# Altium schematic sheet stepper_driver.SchDoc
size A4
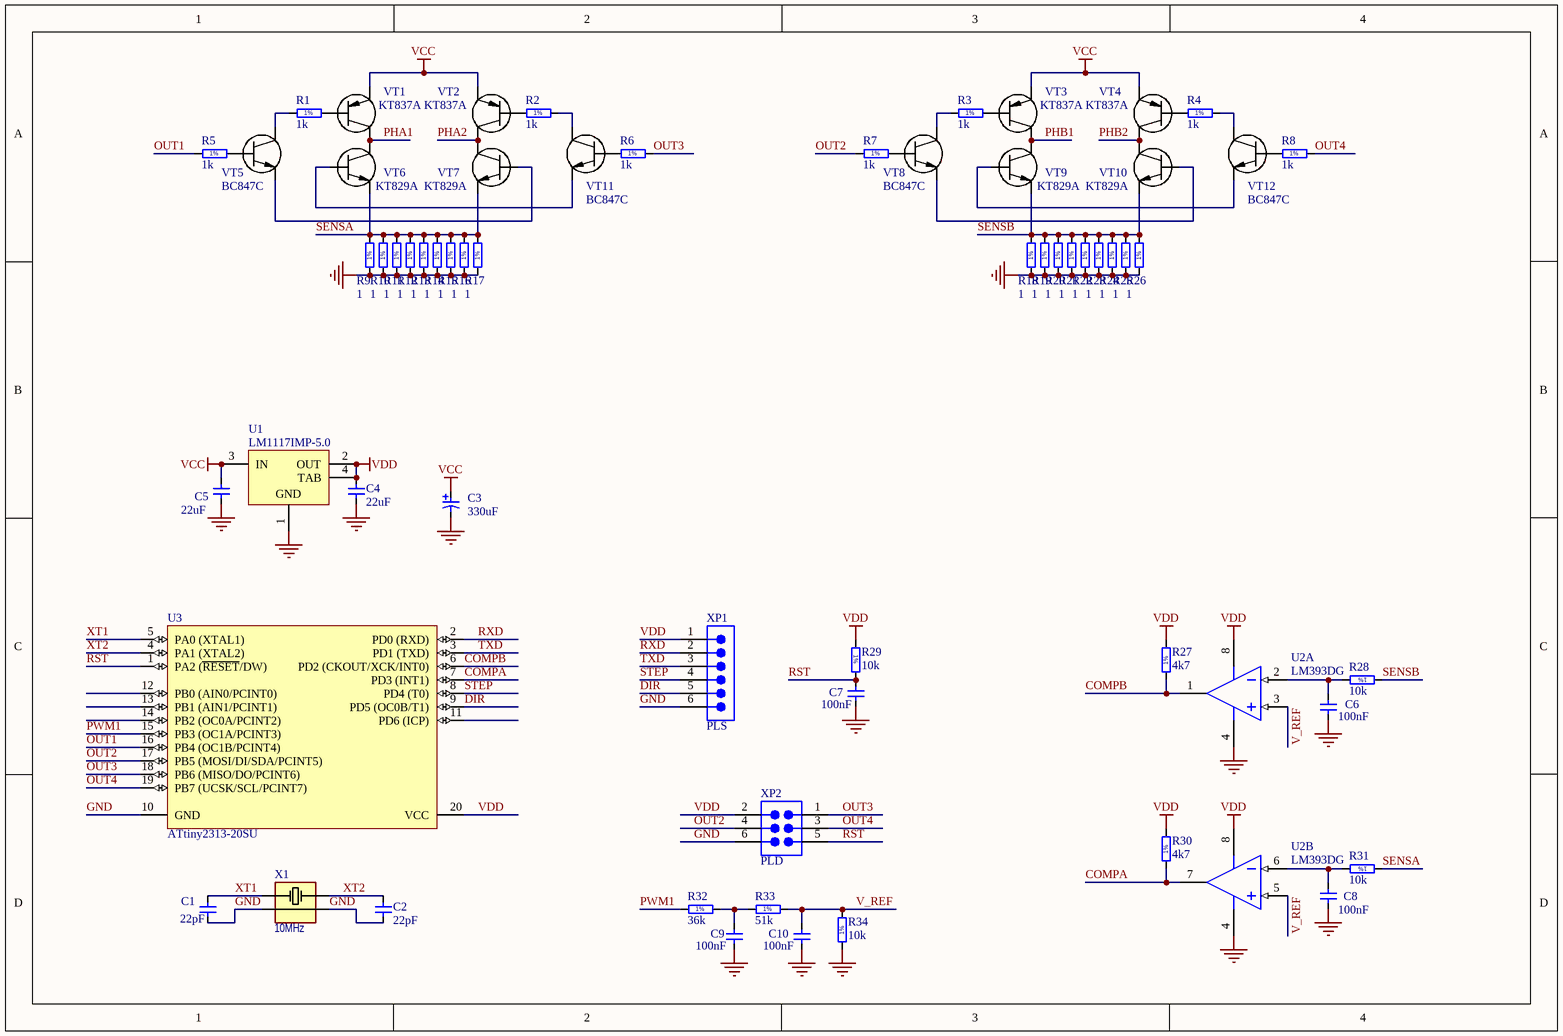
[diagram p0: stepper_driver.SchDoc]

## Parts
C1  22pF  [CAP0805R]
C2  22pF  [CAP0805R]
C3  330uF  [TAN_D]
C4  22uF  [CAP0805R]
C5  22uF  [CAP0805R]
C6  100nF  [CAP0805R]
C7  100nF  [CAP0805R]
C8  100nF  [CAP0805R]
C9  100nF  [CAP0805R]
C10  100nF  [CAP0805R]
R1  1k  [RES0805R]
R2  1k  [RES0805R]
R3  1k  [RES0805R]
R4  1k  [RES0805R]
R5  1k  [RES0805R]
R6  1k  [RES0805R]
R7  1k  [RES0805R]
R8  1k  [RES0805R]
R9  1  [RES1206R]
R10  1  [RES1206R]
R11  1  [RES1206R]
R12  1  [RES1206R]
R13  1  [RES1206R]
R14  1  [RES1206R]
R15  1  [RES1206R]
R16  1  [RES1206R]
R17  1  [RES1206R]
R18  1  [RES1206R]
R19  1  [RES1206R]
R20  1  [RES1206R]
R21  1  [RES1206R]
R22  1  [RES1206R]
R23  1  [RES1206R]
R24  1  [RES1206R]
R25  1  [RES1206R]
R26  1  [RES1206R]
R27  4k7  [RES0805R]
R28  10k  [RES0805R]
R29  10k  [RES0805R]
R30  4k7  [RES0805R]
R31  10k  [RES0805R]
R32  36k  [RES0805R]
R33  51k  [RES0805R]
R34  10k  [RES0805R]
U1  LM1117IMP-5.0  [MP04A_N]
U2  LM393DG  [ONSC-SOIC-8-751-07_V]  (parts A,B of 2)
U3  ATtiny2313-20SU  [20S_L]
VT1  KT837A  [D2PAK]
VT2  KT837A  [D2PAK]
VT3  KT837A  [D2PAK]
VT4  KT837A  [D2PAK]
VT5  BC847C  [SOT23]
VT6  KT829A  [D2PAK]
VT7  KT829A  [D2PAK]
VT8  BC847C  [SOT23]
VT9  KT829A  [D2PAK]
VT10  KT829A  [D2PAK]
VT11  BC847C  [SOT23]
VT12  BC847C  [SOT23]
X1  10MHz  [5032]
XP1  PLS  [PLS-06]
XP2  PLD  [PLD-06]

## Nets
GND: C1.1 C2.1 C3.2 C4.1 C5.1 C6.1 C7.1 C8.1 C9.1 C10.1 R9.1 R10.1 R11.1 R12.1 R13.1 R14.1 R15.1 R16.1 R17.1 R18.1 R19.1 R20.1 R21.1 R22.1 R23.1 R24.1 R25.1 R26.1 R34.1 U1.1(GND) U2.4(GND) U3.10(GND) X1.2 X1.4 XP1.6 XP2.6
VCC: C3.1 C5.2 U1.3(IN) VT1.1(E) VT2.1(E) VT3.1(E) VT4.1(E)
VDD: C4.2 R27.2 R29.1 R30.2 U1.2(OUT) U1.4(TAB) U2.8(VCC) U3.20(VCC) XP1.1 XP2.2
COMPA: R30.1 U2.7(OUTB) U3.7(PD3_(INT1))
COMPB: R27.1 U2.1(OUTA) U3.6(PD2_(CKOUT/XCK/INT0))
DIR: U3.9(PD5_(OC0B/T1)) XP1.5
OUT1: R5.1 U3.16(PB4_(OC1B/PCINT4))
OUT2: R7.1 U3.17(PB5_(MOSI/DI/SDA/PCINT5)) XP2.4
OUT3: R6.2 U3.18(PB6_(MISO/DO/PCINT6)) XP2.1
OUT4: R8.2 U3.19(PB7_(UCSK/SCL/PCINT7)) XP2.3
PHA1: VT1.3(C) VT6.3(C)
PHA2: VT2.3(C) VT7.3(C)
PHB1: VT3.3(C) VT9.3(C)
PHB2: VT4.3(C) VT10.3(C)
PWM1: R32.1 U3.15(PB3_(OC1A/PCINT3))
RST: C7.2 R29.2 U3.1(PA2_(~{RESET}/DW)) XP2.5
RXD: U3.2(PD0_(RXD)) XP1.2
SENSA: R9.2 R10.2 R11.2 R12.2 R13.2 R14.2 R15.2 R16.2 R17.2 R31.1 VT6.2(E) VT7.2(E)
SENSB: R18.2 R19.2 R20.2 R21.2 R22.2 R23.2 R24.2 R25.2 R26.2 R28.1 VT9.2(E) VT10.2(E)
STEP: U3.8(PD4_(T0)) XP1.4
TXD: U3.3(PD1_(TXD)) XP1.3
V_REF: C10.2 R33.2 R34.2 U2.3(INA+) U2.5(INB+)
XT1: C1.2 U3.5(PA0_(XTAL1)) X1.1
XT2: C2.2 U3.4(PA1_(XTAL2)) X1.3
NetC6_2: C6.2 R28.2 U2.2(INA-)
NetC8_2: C8.2 R31.2 U2.6(INB-)
NetC9_2: C9.2 R32.2 R33.1
NetR1_1: R1.1 VT5.3(C)
NetR1_2: R1.2 VT1.2(B)
NetR2_1: R2.1 VT2.2(B)
NetR2_2: R2.2 VT11.3(C)
NetR3_1: R3.1 VT8.3(C)
NetR3_2: R3.2 VT3.2(B)
NetR4_1: R4.1 VT4.2(B)
NetR4_2: R4.2 VT12.3(C)
NetR5_2: R5.2 VT5.1(B)
NetR6_1: R6.1 VT11.1(B)
NetR7_2: R7.2 VT8.1(B)
NetR8_1: R8.1 VT12.1(B)
NetVT5_2: VT5.2(E) VT7.1(B)
NetVT6_1: VT6.1(B) VT11.2(E)
NetVT8_2: VT8.2(E) VT10.1(B)
NetVT9_1: VT9.1(B) VT12.2(E)

Not connected (* = marked no-connect by the designer): U3 11(PD6_(ICP)) 12(PB0_(AIN0/PCINT0)) 13(PB1_(AIN1/PCINT1)) 14(PB2_(OC0A/PCINT2))

## Notes on the sheet
- (in symbol R0805_1K_1%_0.125W_100PPM) 1%
- (in symbol R0805_4K7_1%_0.125W_100PPM) 1%
- (in symbol R0805_10K_1%_0.125W_100PPM) 1%
- (in symbol R0805_36K_1%_0.125W_100PPM) 1%
- (in symbol R0805_51K_1%_0.125W_100PPM) 1%
- (in symbol R1206_1R_1%_0.25W_200PPM) 1%

## Library data of the parts
C1 C2 = CC0805_22PF_50V_5%_NP0: SMD 0805 Capacitor; Part Description: SMD Multilayer Chip Ceramic Capacitor; Manufacturer: GENERIC; Manufacturer1 Part Number: 223886115229; Voltage: 50V; TC: NP0; Tolerance: ±5%; Table: Capacitors SMD; Part Number: CC0805_22PF_50V_5%_NP0; Component Kind: Standard; Component Type: Standard; Pin Count: 2; Value: 22pF; Status: Preferred; Manufacturer Part Number: CC0805_22PF_50V_5%_NP0; Case: 0805; Mounted: Yes; Socket: No; SMD: Yes; Manufacturer1 Example: PHYCOMP; Manufacturer1 ComponentHeight: 1.35mm; HelpURL: \\cern.ch\dfs\Applications\Altium\Datasheets\CC0805_NP0_PHYCOMP.pdf; Author: I. Kuznetsov; CreateDate: 03.12.2007; LatestRevisionDate: 03.12.2007; Manufacturer Part Number 2: CC0805JPNPO9BN220
C3 = T495D337M010AHE100: Voltage: 10V; Table: Tantalum; Part Number: T495D337M010AHE100; Value: 330uF
C4 C5 = CC0805_22UF_16V_10%_X5R: SMD 0805 Capacitor; Part Description: SMD Multilayer Chip Ceramic Capacitor; Manufacturer: GENERIC; Manufacturer1 Part Number: C2012X5R1C226KT; Voltage: 16V; TC: X5R; Tolerance: ±10%; Table: Capacitors SMD; Part Number: CC0805_22UF_16V_10%_X5R; Component Kind: Standard; Component Type: Standard; Pin Count: 2; Value: 22uF; Status: Preferred; Manufacturer Part Number: CC0805_22UF_16V_10%_X5R; Case: 0805; Mounted: Yes; Socket: No; SMD: Yes; Manufacturer1 Example: TDK; Manufacturer1 ComponentHeight: 1.35mm; HelpURL: \\cern.ch\dfs\Applications\Altium\Datasheets\CC0805_X5R_TDK_C.pdf; Author: I. Kuznetsov; CreateDate: 25.10.2012; LatestRevisionDate: 25.10.2012
C6-C10 = CC0805_100NF_50V_10%_X7R: SMD 0805 Capacitor; Part Description: SMD Multilayer Chip Ceramic Capacitor; Manufacturer: GENERIC; Manufacturer1 Part Number: B37941K5104K62; Voltage: 50V; TC: X7R; Tolerance: ±10%; Table: Capacitors SMD; Part Number: CC0805_100NF_50V_10%_X7R; Component Kind: Standard; Component Type: Standard; Pin Count: 2; Value: 100nF; Status: Preferred; Manufacturer Part Number: CC0805_100NF_50V_10%_X7R; Case: 0805; Mounted: Yes; Socket: No; SMD: Yes; Manufacturer1 Example: EPCOS; Manufacturer1 ComponentHeight: 1.35mm; HelpURL: \\cern.ch\dfs\Applications\Altium\Datasheets\CC0805_X7R_EPCOS.pdf; Author: I. Kuznetsov; CreateDate: 03.12.2007; LatestRevisionDate: 03.12.2007
R1-R8 = R0805_1K_1%_0.125W_100PPM: Part Description: General Purpose Thick Film Chip Resistor; Manufacturer: GENERIC; Manufacturer1 Part Number: NRC10F1001TRF; Power: 0.125W; TC: ±100ppm/°C; Tolerance: ±1%; Table: Resistors SMD; Part Number: R0805_1K_1%_0.125W_100PPM; Component Kind: Standard; Component Type: Standard; Footprint: RESC2012X60N; Pin Count: 2; Value: 1k; Status: Preferred; Manufacturer Part Number: R0805_1K_1%_0.125W_100PPM; Case: 0805; Mounted: Yes; Socket: No; SMD: Yes; Manufacturer1 Example: NIC COMPONENT; Manufacturer1 ComponentHeight: 0.6mm; HelpURL: \\cern.ch\dfs\Applications\Altium\Datasheets\R0805_NIC_NRC.pdf; Author: CERN DEM JLC; CreateDate: 03.12.2007; LatestRevisionDate: 13.03.2008
R9-R26 = R1206_1R_1%_0.25W_200PPM: Part Description: General Purpose Thick Film Chip Resistor; Manufacturer: GENERIC; Manufacturer1 Part Number: 232272461008L or RC1206FR-071RL; Power: 0.25W; TC: ±200ppm/°C; Tolerance: ±1%; Table: Resistors SMD; Part Number: R1206_1R_1%_0.25W_200PPM; Component Kind: Standard; Component Type: Standard; Footprint: RESC3216X65N; Pin Count: 2; Value: 1; Status: Preferred; Manufacturer Part Number: R1206_1R_1%_0.25W_200PPM; Case: 1206; Mounted: Yes; Socket: No; SMD: Yes; Manufacturer1 Example: YAGEO PHYCOMP; Manufacturer1 ComponentHeight: 0.65mm; HelpURL: \\cern.ch\dfs\Applications\Altium\Datasheets\R1206_Phycomp_RC1206.pdf; Author: CERN DEM JLC; CreateDate: 03.12.2007; LatestRevisionDate: 17.10.2012
R27 R30 = R0805_4K7_1%_0.125W_100PPM: Part Description: General Purpose Thick Film Chip Resistor; Manufacturer: GENERIC; Manufacturer1 Part Number: NRC10F4701TRF; Power: 0.125W; TC: ±100ppm/°C; Tolerance: ±1%; Table: Resistors SMD; Part Number: R0805_4K7_1%_0.125W_100PPM; Component Kind: Standard; Component Type: Standard; Footprint: RESC2012X60N; Pin Count: 2; Value: 4k7; Status: Preferred; Manufacturer Part Number: R0805_4K7_1%_0.125W_100PPM; Case: 0805; Mounted: Yes; Socket: No; SMD: Yes; Manufacturer1 Example: NIC COMPONENT; Manufacturer1 ComponentHeight: 0.6mm; HelpURL: \\cern.ch\dfs\Applications\Altium\Datasheets\R0805_NIC_NRC.pdf; Author: CERN DEM JLC; CreateDate: 03.12.2007; LatestRevisionDate: 13.03.2008
R28 R29 R31 R34 = R0805_10K_1%_0.125W_100PPM: Part Description: General Purpose Thick Film Chip Resistor; Manufacturer: GENERIC; Manufacturer1 Part Number: NRC10F1002TRF; Power: 0.125W; TC: ±100ppm/°C; Tolerance: ±1%; Table: Resistors SMD; Part Number: R0805_10K_1%_0.125W_100PPM; Component Kind: Standard; Component Type: Standard; Footprint: RESC2012X60N; Pin Count: 2; Value: 10k; Status: Preferred; Manufacturer Part Number: R0805_10K_1%_0.125W_100PPM; Case: 0805; Mounted: Yes; Socket: No; SMD: Yes; Manufacturer1 Example: NIC COMPONENT; Manufacturer1 ComponentHeight: 0.6mm; HelpURL: \\cern.ch\dfs\Applications\Altium\Datasheets\R0805_NIC_NRC.pdf; Author: CERN DEM JLC; CreateDate: 03.12.2007; LatestRevisionDate: 13.03.2008
R32 = R0805_36K_1%_0.125W_100PPM: Part Description: General Purpose Thick Film Chip Resistor; Manufacturer: GENERIC; Manufacturer1 Part Number: NRC10F3602TRF; Power: 0.125W; TC: ±100ppm/°C; Tolerance: ±1%; Table: Resistors SMD; Part Number: R0805_36K_1%_0.125W_100PPM; Component Kind: Standard; Component Type: Standard; Footprint: RESC2012X60N; Pin Count: 2; Value: 36k; Status: Preferred; Manufacturer Part Number: R0805_36K_1%_0.125W_100PPM; Case: 0805; Mounted: Yes; Socket: No; SMD: Yes; Manufacturer1 Example: NIC COMPONENT; Manufacturer1 ComponentHeight: 0.6mm; HelpURL: \\cern.ch\dfs\Applications\Altium\Datasheets\R0805_NIC_NRC.pdf; Author: CERN DEM JLC; CreateDate: 03.12.2007; LatestRevisionDate: 13.03.2008
R33 = R0805_51K_1%_0.125W_100PPM: Part Description: General Purpose Thick Film Chip Resistor; Manufacturer: GENERIC; Manufacturer1 Part Number: NRC10F5102TRF; Power: 0.125W; TC: ±100ppm/°C; Tolerance: ±1%; Table: Resistors SMD; Part Number: R0805_51K_1%_0.125W_100PPM; Component Kind: Standard; Component Type: Standard; Footprint: RESC2012X60N; Pin Count: 2; Value: 51k; Status: Preferred; Manufacturer Part Number: R0805_51K_1%_0.125W_100PPM; Case: 0805; Mounted: Yes; Socket: No; SMD: Yes; Manufacturer1 Example: NIC COMPONENT; Manufacturer1 ComponentHeight: 0.6mm; HelpURL: \\cern.ch\dfs\Applications\Altium\Datasheets\R0805_NIC_NRC.pdf; Author: CERN DEM JLC; CreateDate: 03.12.2007; LatestRevisionDate: 13.03.2008
U1 = CMP-0062-01629-3: 800mA Low-Dropout Linear Regulator, 4-pin SOT-223; Manufacturer: National Semiconductor; CompType: LDO IC; PackageTopMarking: XYTT*N06B; PowerWise: N; High-Reliability: Y; PinCount: 4; ComponentLink2URL: http://www.national.com/ds/LM/LM1117.pdf; PartNumber: LM1117IMP-5.0; ComponentLink3URL: http://www.national.com/pf/LM/LM1117.html; RoHS: N; PackageVersion: revB, Apr-2003; DatasheetVersion: Apr-2006; ComponentLink3Description: LM1117 Web Page; ComponentLink1URL: http://www.national.com/; Code_JEDEC: TO-261-AA; ComponentLink2Description: LM1117 Datasheet; ComponentLink1Description: Manufacturer URL; RevisionNote: SCH symbol layout adjusted; Code_IPC: SOT223-4; PackageDescription: Molded SOT-223, 6.50 x 3.56 x 1.6mm Body, 4 Lead, 2.3mm Pitch; ComponentLink4Description: MP04A Package Page; PackageReference: MP04A; ComponentLink4URL: http://www.national.com/packaging/folders/mp04a.html
U2 = CMP-1305-00047-1: Low Offset Voltage Dual Comparators, 2 to 36 V, 0 to 70 degC, 8-Pin SOIC, Pb-Free, Tube; Manufacturer: On Semiconductor; VCC Max (V): 36; VCC Min (V): 2; IO Typ (mA): 16; ICC Typ (mA): 0.4; RoHS: TRUE; ComponentLink3Description: Package Specification; ComponentLink1URL: http://www.onsemi.com/; PartNumber: LM393DG; ComponentLink3URL: http://www.onsemi.com/pub_link/Collateral/751-07.PDF; ComponentLink2URL: http://www.onsemi.com/pub_link/Collateral/LM393-D.PDF; Packing: Tube; Mounting Technology: Surface Mount; DatasheetVersion: Rev. 25; ComponentLink2Description: Datasheet; PackageDescription: 8-Pin Small Outline Integrated Circuit, Body 4.9 x 3.9 mm, Pitch 1.27 mm; ComponentLink1Description: Manufacturer URL; PackageVersion: Rev. AK, 02/2011; PackageReference: SOIC-8-751-07
U3 = CMP-0093-00143-2: Low Power tinyAVRÂ® 8-Bit Microcontroller, 2.7-5.5V, 20MHz, 2K Flash Memory, Industrial Grade (-40Â°C to 85Â°C), 20-Lead SOIC, Pb-Free; DatasheetVersion: revL, Aug-2010; ComponentLink1Description: Manufacturer URL; ComponentLink3Description: ATtiny2313 Summary; Code_JEDEC: MS-013-AC; PackageDescription: 20-lead, 0.300" Wide Body, Plastic Gull Wing Small Outline Package (SOIC); RevisionNote: DatasheetVersion & PackageVersion updated. URLs added.; ComponentLink2URL: http://www.atmel.com/dyn/resources/prod_documents/doc2543.pdf; ComponentLink3URL: http://www.atmel.com/dyn/resources/prod_documents/doc2543S.pdf; Code_IPC: SOIC127P1030-20; ComponentLink2Description: ATtiny2313 Datasheet; PackageReference: 20S; ComponentLink1URL: http://www.atmel.com/; PackageVersion: revB, Nov-2006
VT1-VT4 = KT837A: Part Description: PNP; Table: Transistors; Part Number: KT837A; Device: KT837A
VT5 VT8 VT11 VT12 = BC847C: Part Description: NPN 45В/0.1А Кус.=420-800; Table: Transistors; Part Number: BC847C; Component Kind: Standard; Component Type: Standard; Device: BC847C; Status: Active; Case: SOT23; Mounted: Yes; Socket: No; SMD: Yes; Author: I. Kuznetsov
VT6 VT7 VT9 VT10 = KT829A: Part Description: NPN; Table: Transistors; Part Number: KT829A; Device: KT829A
X1 = KX-9AT 10.0 MHz 30/50/50 16 pF: 3*2.5 mm SMD Crystall; Device: KX-9AT 16.0 MHz 30/50/50 16 pF; Part Number: KX-9AT 10.0 MHz 30/50/50 16 pF; Value: 10MHz; Table: Crystall
XP1 = PLS-06: Manufacturer: AUK; Part Number: PLS-06; Component Kind: Standard; Component Type: Standard; PackageDescription: PLS-06; Pin Count: 6; Family: PLS; SMD: Yes; Device: PLS-06; Manufacturer Part Number: PLS-06; Table: AUK
XP2 = PLD-06: Table: AUK; Part Number: PLD-06; Family: PLD; Device: PLD-06